# Altium schematic sheet Sensors.SchDoc
size B; SheetNumber: 2; SheetTotal: 3
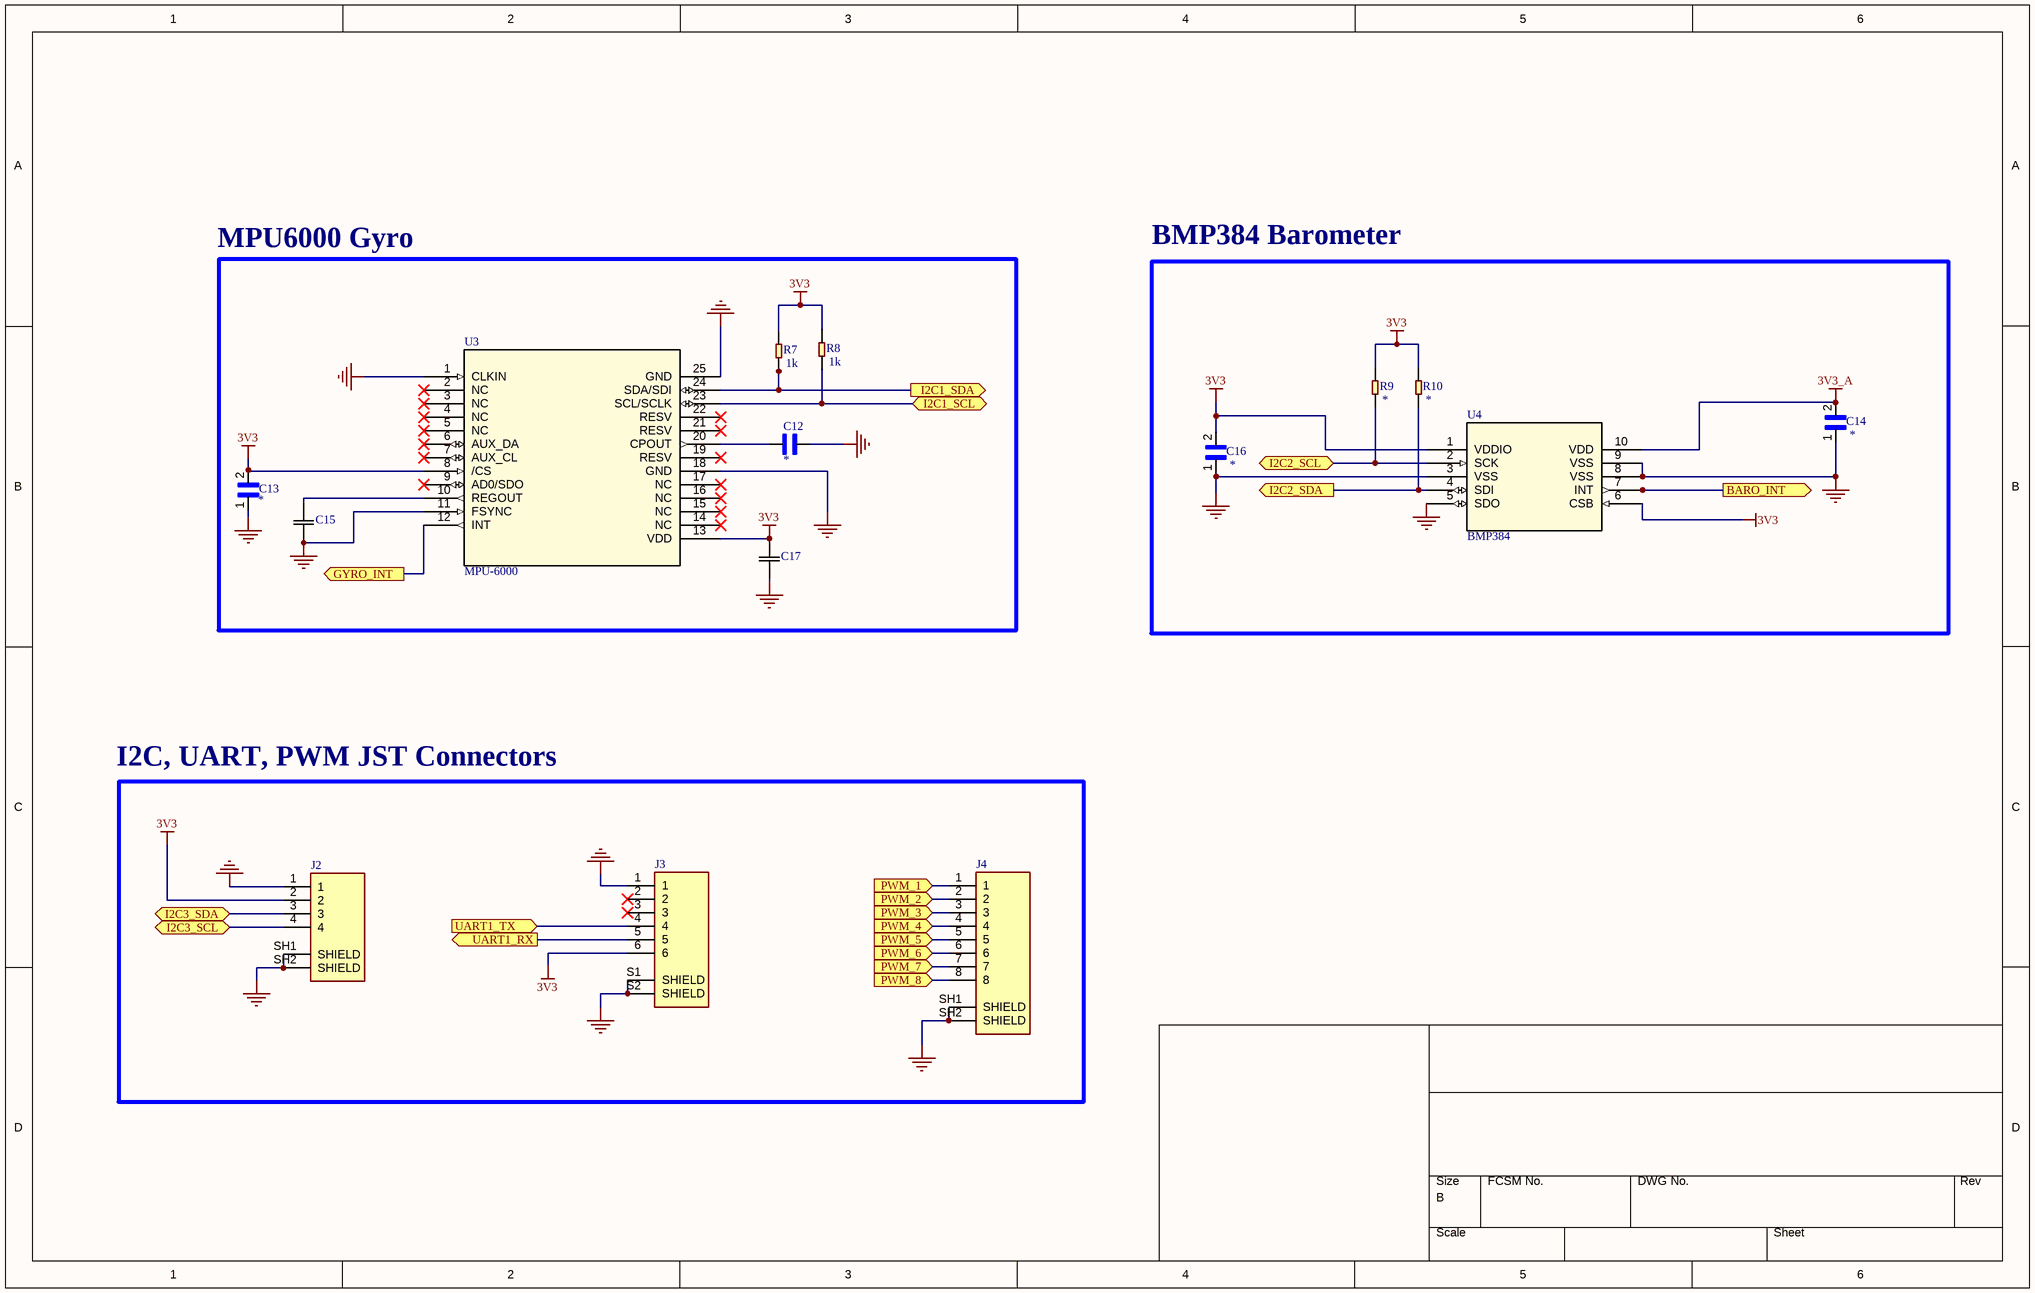
[diagram p0: Sensors.SchDoc]

## Parts
C12  GRM155R70J222KA01D  [CAPC1005X55N]  (value not drawn)
C13  GRM033R71A103KA01D  [CAPC0603X33N]  (value not drawn)
C14  GRM033R61A104KE15D  [CAPC0603X33N]  (value not drawn)
C15  CC0201MRX5R6BB105  [CAP_CC0201_YAG]  (value not drawn)
C16  GRM033R61A104KE15D  [CAPC0603X33N]  (value not drawn)
C17  CC0201MRX5R6BB105  [CAP_CC0201_YAG]  (value not drawn)
J2  SM04B-GHS-TB(LF)(SN)-  [JST_SM04B-GHS-TB(LF)(SN)-]  (value not drawn)
J3  SM06B-GHS-TB(LF)(SN)  [JST_SM06B-GHS-TB(LF)(SN)]  (value not drawn)
J4  SM08B-GHS-TB(LF)(SN)  [JST_SM08B-GHS-TB(LF)(SN)]  (value not drawn)
R7  value 1k  [R0402]  (hidden comment: SMD-RES-1K-5%-1/16W(0402))
R8  value 1k  [R0402]  (hidden comment: SMD-RES-1K-5%-1/16W(0402))
R9  SMD-RES-1K-5%-1/16W(0402)  [R0402]  (value not drawn)
R10  SMD-RES-1K-5%-1/16W(0402)  [R0402]  (value not drawn)
U3  MPU-6000  [QFN24_4X4X0P9_IVS]
U4  BMP384  [LGA10_2.0X2.0X0.95_BOS]

## Blocks framed on the sheet
MPU6000 Gyro: C12 C13 C15 C17 R7 R8 U3
BMP384 Barometer: C14 C16 R9 R10 U4
I2C, UART, PWM JST Connectors: J2-J4

## Ports
BARO_INT (out), GYRO_INT (out), I2C1_SCL (bidir), I2C1_SDA (out), I2C2_SCL (bidir), I2C2_SDA (out), I2C3_SCL (bidir), I2C3_SDA (bidir), PWM_1 (in), PWM_2 (in), PWM_3 (in), PWM_4 (in), PWM_5 (in), PWM_6 (in), PWM_7 (in), PWM_8 (in), UART1_RX (out), UART1_TX (in)

## Nets
3V3: C13.2 C16.2 C17.2 J2.2 J3.6 R7.2 R8.2 R9.2 R10.2 U3.8(/CS) U3.13(VDD) U4.1(VDDIO) U4.6(CSB)
3V3_A: C14.2 U4.10(VDD)
GND: C12.1 C13.1 C14.1 C15.1 C16.1 C17.1 J2.1 J2.SH1(SHIELD) J2.SH2(SHIELD) J3.1 J3.S1(SHIELD) J3.S2(SHIELD) J4.SH1(SHIELD) J4.SH2(SHIELD) U3.1(CLKIN) U3.11(FSYNC) U3.18(GND) U3.25(GND) U4.3(VSS) U4.5(SDO) U4.8(VSS) U4.9(VSS)
BARO_INT: U4.7(INT) ; port BARO_INT
GYRO_INT: U3.12(INT) ; port GYRO_INT
I2C1_SCL: R8.1 U3.23(SCL/SCLK) ; port I2C1_SCL
I2C1_SDA: R7.1 U3.24(SDA/SDI) ; port I2C1_SDA
I2C2_SCL: R9.1 U4.2(SCK) ; port I2C2_SCL
I2C2_SDA: R10.1 U4.4(SDI) ; port I2C2_SDA
I2C3_SCL: J2.4 ; port I2C3_SCL
I2C3_SDA: J2.3 ; port I2C3_SDA
PWM_1: J4.1 ; port PWM_1
PWM_2: J4.2 ; port PWM_2
PWM_3: J4.3 ; port PWM_3
PWM_4: J4.4 ; port PWM_4
PWM_5: J4.5 ; port PWM_5
PWM_6: J4.6 ; port PWM_6
PWM_7: J4.7 ; port PWM_7
PWM_8: J4.8 ; port PWM_8
UART1_RX: J3.5 ; port UART1_RX
UART1_TX: J3.4 ; port UART1_TX
NetC12_2: C12.2 U3.20(CPOUT)
NetC15_2: C15.2 U3.10(REGOUT)

Not connected (* = marked no-connect by the designer): J3 2* 3*; U3 2(NC)* 3(NC)* 4(NC)* 5(NC)* 6(AUX_DA)* 7(AUX_CL)* 9(AD0/SDO)* 14(NC)* 15(NC)* 16(NC)* 17(NC)* 19(RESV)* 21(RESV)* 22(RESV)*

## Notes on the sheet
- DWG. NO.
- REV.
- SHT.
- THIS DOCUMENT AND THE DATA DISCLOSED HEREIN OR HEREWITH IS THE PROPERTY OF ALTIUM LIMITED AND MAY BE FREELY DISTRIBUTED IN WHOLE. NO RIGHTS ARE RESERVED OR EXPRESS OR IMPLIED WARANTEE GIVEN.
- REVISION
- DESCRIPTION
- DATE
- APPROVED
- ENG:
- APPROVALS
- PROJECT
- DSN:
- CHK:
- REFERENCE DOCUMENTS
- PROJECT REVISION:
- TITLE
- DOCUMENT REVISION:
- DESIGN ITEM:
- BOM:
- FAB DWG:
- PCB DWG:
- ASSY DWG:
- SCALE:
- SIZE
- B
- CAGE CODE
- FILE NAME
- DWG NO.
- SHEET
- OF
- REV

## Library data of the parts
C12 = GRM155R70J222KA01D: Cap Ceramic 0.0022uF 6.3V X7R 10% SMD 0402 125Â°C Paper T/R; Package: None; Price: None; Value: *; MP: GRM155R70J222KA01D; Availability: Unavailable
C13 = GRM033R71A103KA01D: SMD Capacitor X7R(EIA) with Capacitance: 10000pF Tol. 10%. Rated Voltage: 10Vdc; MF: Murata; MP: GRM033R71A103KA01D; Availability: Unavailable; SnapEDA_Link: https://www.snapeda.com/parts/GRM033R71A103KA01D/Murata/view-part/4379446/?ref=snap; Value: *; Check_prices: https://www.snapeda.com/parts/GRM033R71A103KA01D/Murata/view-part/4379446/?ref=eda; Package: 0603 Taiyo Yuden; Price: None
C14 C16 = GRM033R61A104KE15D: SMD capacitor X5R(EIA) with capacitance 0.10uF Tol.10%. Rated voltage 10Vdc 85C; MF: Murata Electronics; Check_prices: https://www.snapeda.com/parts/GRM033R61A104KE15D/Murata%20Electronics%20North%20America/view-part/104758/?ref=eda; Value: *; Availability: Warning; Price: None; Package: 0603 Taiyo Yuden; MP: GRM033R61A104KE15D; Purchase-URL: https://pricing.snapeda.com/search/part/GRM033R61A104KE15D/?ref=eda; SnapEDA_Link: https://www.snapeda.com/parts/GRM033R61A104KE15D/Murata%20Electronics%20North%20America/view-part/104758/?ref=snap
C15 C17 = CC0201MRX5R6BB105: No Description Available; Mfr_Name: Yageo
J2 = SM04B-GHS-TB(LF)(SN)-: Connector Header Surface Mount, Right Angle 4 position 0.049 _1.25mm_; MP: SM04B-GHS-TB_LF__SN_-; MF: JST Sales; Availability: Unavailable; Package: None; Value: *; Price: None; SnapEDA_Link: https://www.snapeda.com/parts/SM04B-GHS-TB%28LF%29%28SN%29-/JST%20Sales%20America%20Inc./view-part/2759740/?ref=snap
J3 = SM06B-GHS-TB(LF)(SN): ÐŸÐ¾Ð²ÐµÑ€Ñ…Ð½Ð¾ÑÑ‚Ð½Ñ‹Ð¹ Ð¼Ð¾Ð½Ñ‚Ð°Ð¶ Ñ€Ð°Ð·ÑŠÐµÐ¼Ð°, Ð¿Ñ€ÑÐ¼Ð¾Ð¹ ÑƒÐ³Ð¾Ð» 6, Ð¿Ð¾Ð»Ð¾Ð¶ÐµÐ½Ð¸Ðµ 0,049 _1,25 Ð¼Ð¼_; MP: SM06B-GHS-TB_LF__SN_; MF: JST Sales; Value: *; Package: None; Price: None; Availability: Unavailable; SnapEDA_Link: https://www.snapeda.com/parts/SM06B-GHS-TB%28LF%29%28SN%29/JST%20Sales%20America%20Inc./view-part/817690/?ref=snap
J4 = SM08B-GHS-TB(LF)(SN): Connector Header Surface Mount, Right Angle 8 position 0.049 _1.25mm_; MF: JST Sales; MP: SM08B-GHS-TB_LF__SN_; Value: *; Digi-Key_Part_Number: 455-1570-1-ND; Package: None; Digi-Key_Purchase_URL: https://www.digikey.com/product-detail/en/jst-sales-america-inc/SM08B-GHS-TB_LF__SN_/455-1570-1-ND/807838?utm_source=snapeda&utm_medium=aggregator&utm_campaign=symbol; SnapEDA_Link: https://www.snapeda.com/parts/SM08B-GHS-TB%28LF%29%28SN%29/JST%20Sales%20America%20Inc./view-part/1162121/?ref=snap
R7-R10 = SMD-RES-1K-5%-1/16W(0402): 1 kOhms Â±5% 0.063W, 1/16W Chip Resistor 0402 (1005 Metric) Moisture Resistant Thick Film; MP: RC0402JR-071KL; MF: Yageo; Check_prices: https://www.snapeda.com/parts/RC0402JR-071KL/Yageo/view-part/?ref=eda; Purchase-URL: https://pricing.snapeda.com/search/part/RC0402JR-071KL/?ref=eda; SnapEDA_Link: https://www.snapeda.com/parts/RC0402JR-071KL/Yageo/view-part/?ref=snap; Package: 0402 Yageo; Digi-Key_Part_Number: 311-1.0KJRTR-ND
  R9 R10: Value: *
U3 = MPU-6000: No Description Available; Mfr_Name: InvenSense; RefDes: RefDes; Type: Type
U4 = BMP384: No Description Available; Mfr_Name: Bosch Sensortec; RefDes: RefDes; Type: Type